# Altium schematic sheet [11]-MAIN_POWER.SchDoc
size A4
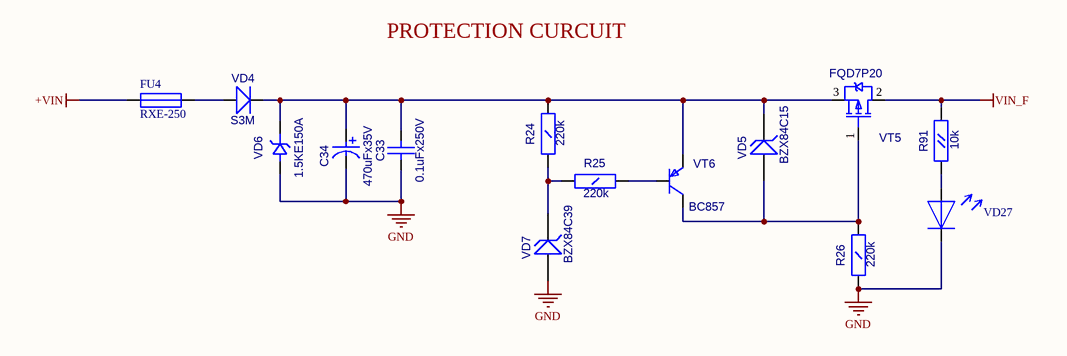
[diagram p0: [11]-MAIN_POWER.SchDoc]

## Parts
C33  0.1uFx250V  [CC1206]
C34  value 470uFx35V  [CC16X10_CAP0.5(1)(Primary)]  (hidden comment: CAP0.5(1))
FU4  RXE-250  [RXE-250_FLAT]
R24  220k  [RC1206]
R25  220k  [RC1206]
R26  220k  [RC1206]
R91  10k  [RC0603]
VD4  S3M  [SMC]
VD5  BZX84C15  [SOT-23(123)]
VD6  1.5KE150A  [DO-201_FLAT]
VD7  BZX84C39  [SOT-23(123)]
VD27  LED_0805  [LED0805]  (value not drawn)
VT5  FQD7P20  [D-PAK(TO-252AA)]
VT6  BC857  [SOT-23(123)]

## Nets
+VIN: FU4.1
GND: C33.1(A) C34.1 R26.1(A) VD6.1(A) VD7.1(A) VD27.2
VIN_F: R91.2(B) VT5.2(D)
NetC33_2: C33.2(B) C34.2 R24.2(B) VD4.2(K) VD5.3(K) VD6.2(K) VT5.3(S) VT6.2(E)
NetFU4_2: FU4.2 VD4.1(A)
NetR24_1: R24.1(A) R25.1(A) VD7.3(K)
NetR25_2: R25.2(B) VT6.1(B)
NetR26_2: R26.2(B) VD5.1(A) VT5.1(G) VT6.3(C)
NetR91_1: R91.1(A) VD27.1

## Notes on the sheet
- PROTECTION CURCUIT

## Library data of the parts
C33 = CC1206: Value: 0.1uFx250V
R24-R26 = RC1206: Value: 220k
R91 = RC0603: Value: 10k
VD4 = S3A: Schottky Rectifier; Value: S3M
VD5 VD7 = BZX84: Zener Voltage Regulator Diode
  VD5: Value: BZX84C15
  VD7: Value: BZX84C39
VD6 = 1.5KE: Value: 1.5KE150A
VT5 = IRFR9220: HEXFET Power MOSFET; OriginalName: IRLML5103; ComponentField7: Published 8-Jun-2000; Value: FQD7P20
VT6 = BC857B: PNP 100ma transistor; OriginalName: BC846BLT1; ComponentField7: Published 29-Sep-2000; Value: BC857
FU4 = RXE-250: Value: RXE-250
VD27 = LED_0805: Value: LED_0805